# EAGLE design lcd_panel_adapter (EAGLE 9.6.2)
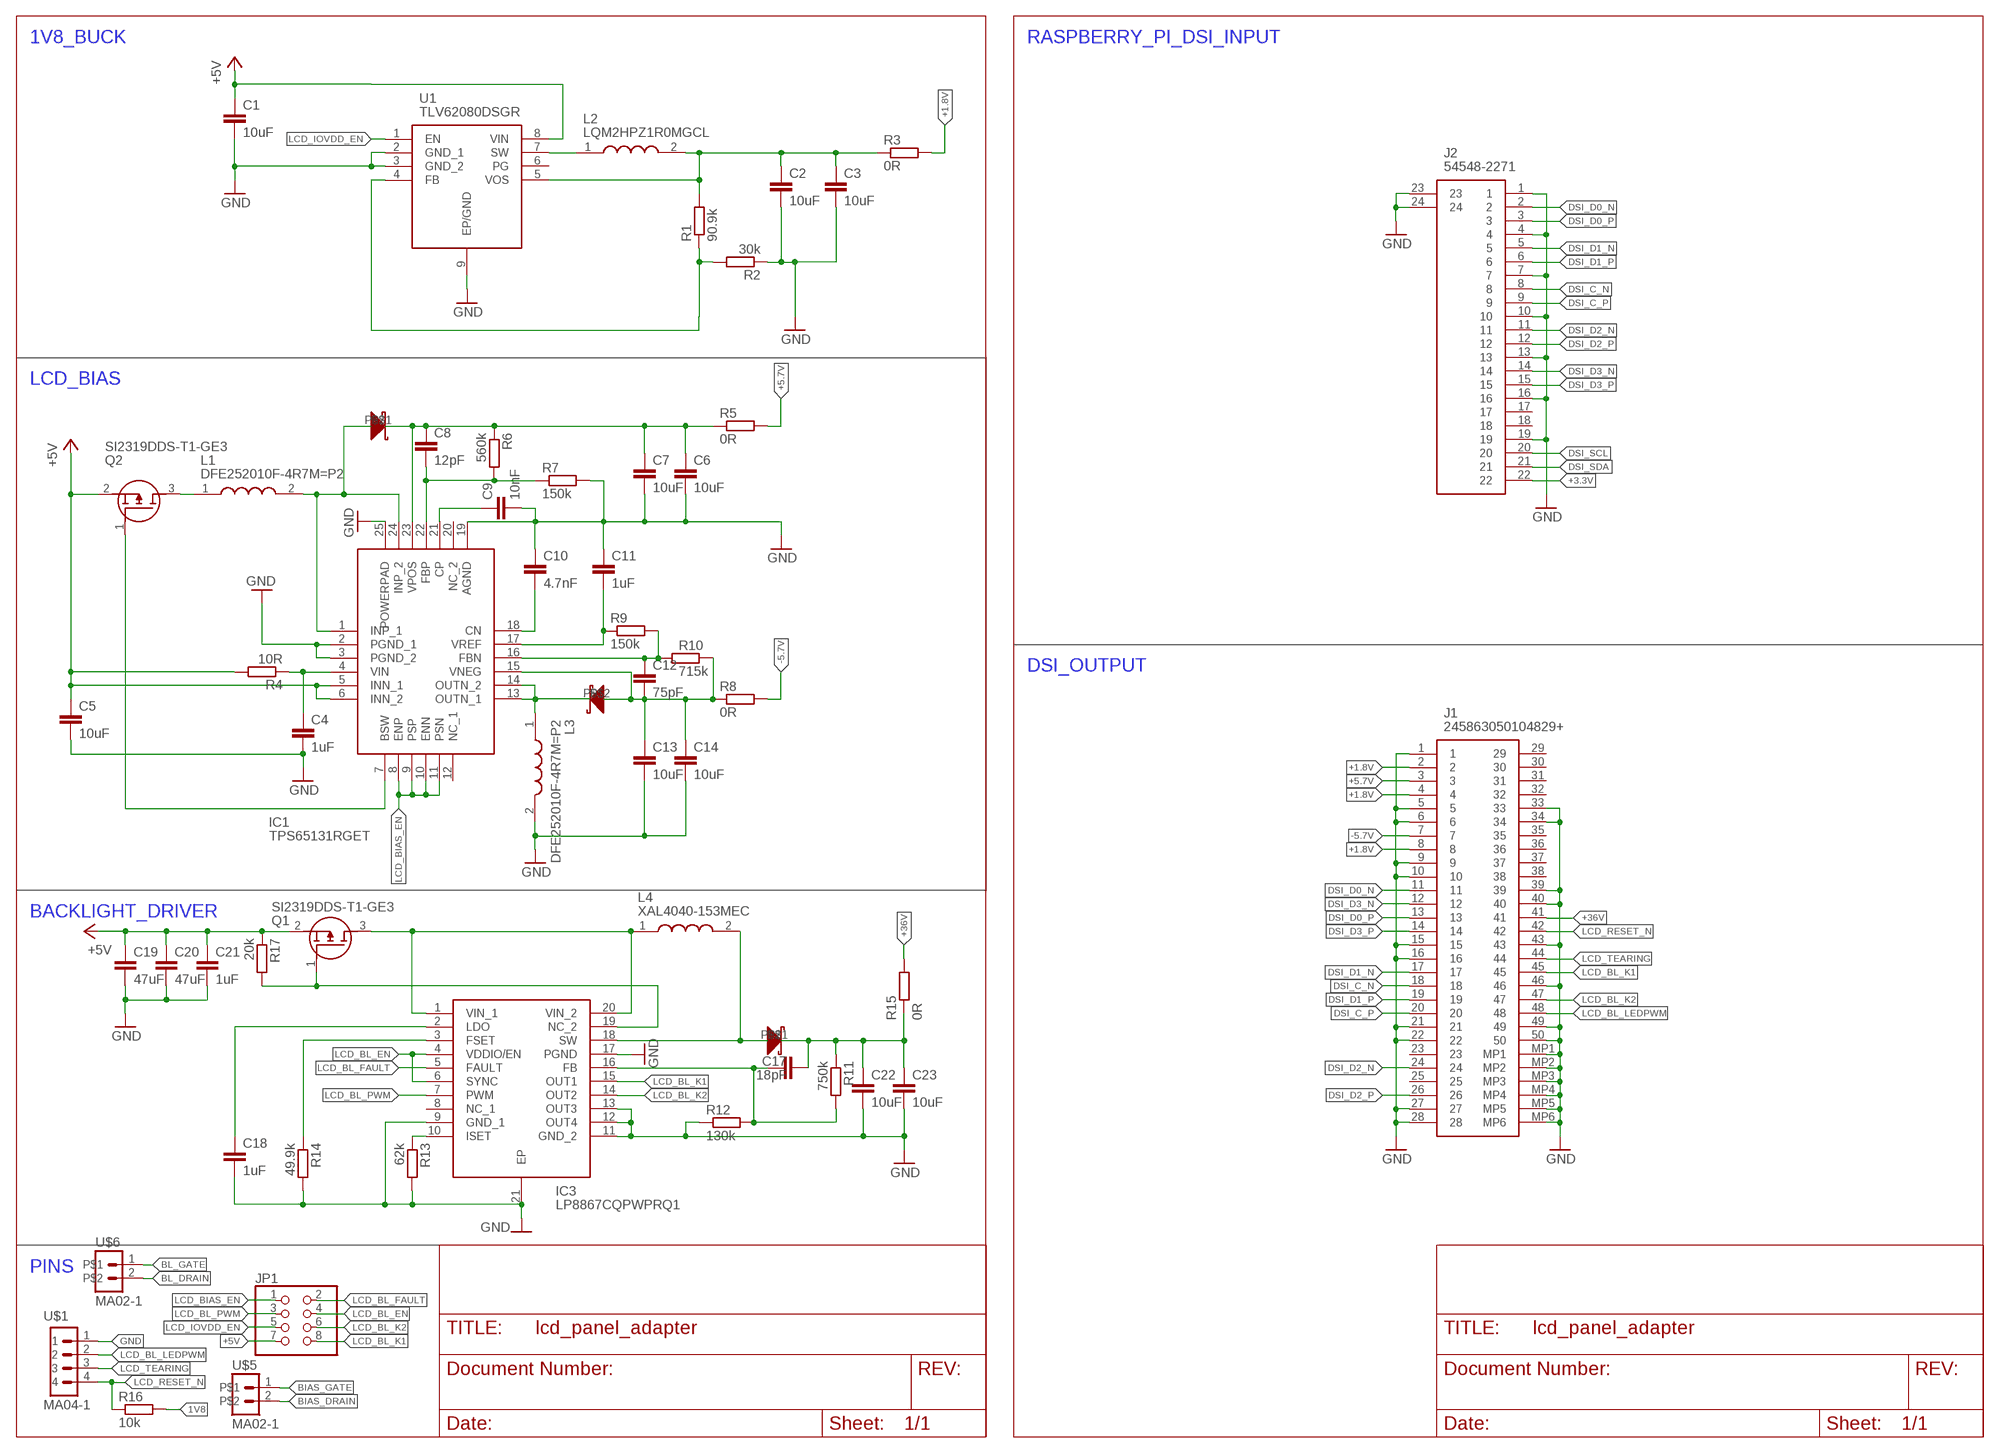
[diagram p0: schematic, sheet 1]

## Parts
C1  10uF  C-EUC0603  [C0603]
C2  10uF  C-EUC0603  [C0603]
C3  10uF  C-EUC0603  [C0603]
C4  1uF  C-EUC0603  [C0603]
C5  10uF  C-EUC0603  [C0603]
C6  10uF  C-EUC0603  [C0603]
C7  10uF  C-EUC0603  [C0603]
C8  12pF  C-EUC0603  [C0603]
C9  10nF  C-EUC0603  [C0603]
C10  4.7nF  C-EUC0603  [C0603]
C11  1uF  C-EUC0603  [C0603]
C12  75pF  C-EUC0603  [C0603]
C13  10uF  C-EUC0603  [C0603]
C14  10uF  C-EUC0603  [C0603]
C17  18pF  C-EUC0603  [C0603]
C18  1uF  C-EUC0603  [C0603]
C19  47uF  C-EUC0603  [C0603]
C20  47uF  C-EUC0603  [C0603]
C21  1uF  C-EUC0603  [C0603]
C22  10uF  C-EUC1206  [C1206]
C23  10uF  C-EUC1206  [C1206]
IC1  TPS65131RGET  [QFN50P400X400X100-25N]
IC3  LP8867CQPWPRQ1  TPS61194PWPR  [SOP65P640X120-21N]
J1  245863050104829+  [245863050104829]
J2  54548-2271  [545482271]
JP1  PINHD-2X4  [2X04]
L1  DFE252010F-4R7M=P2  [1269ASH100NP2]
L2  LQM2HPZ1R0MGCL  [LQM2HPN1R0MG0L]
L3  DFE252010F-4R7M=P2  [1269ASH100NP2]
L4  XAL4040-153MEC  [XAL4040153MEC]
Q1  SI2319DDS-T1-GE3  [SOT96P240X120-3N]
Q2  SI2319DDS-T1-GE3  [SOT96P240X120-3N]
R1  90.9k  R-EU_R0603  [R0603]
R2  30k  R-EU_R0603  [R0603]
R3  0R  R-EU_R0603  [R0603]
R4  10R  R-EU_R0603  [R0603]
R5  0R  R-EU_R0603  [R0603]
R6  560k  R-EU_R0603  [R0603]
R7  150k  R-EU_R0603  [R0603]
R8  0R  R-EU_R0603  [R0603]
R9  150k  R-EU_R0603  [R0603]
R10  715k  R-EU_R0603  [R0603]
R11  750k  R-EU_R0603  [R0603]
R12  130k  R-EU_R0603  [R0603]
R13  62k  R-EU_R0603  [R0603]
R14  49.9k  R-EU_R0603  [R0603]
R15  0R  R-EU_R0603  [R0603]
R16  10k  R-EU_R0603  [R0603]
R17  20k  R-EU_R0603  [R0603]
U1  TLV62080DSGR  [SON50P200X200X80-9N]
U$1  MA04-1  [MA04-1]
U$2  CUS10S40  [CUS10S40]
U$3  CUS10S40  [CUS10S40]
U$4  CUS10S40  [CUS10S40]
U$5  MA02-1  [MA02-1]
U$6  MA02-1  [MA02-1]

## Nets
1V8: C2.1 C3.1 L2.2 R1.2 R3.1 R16.2 U1.5(VOS)
+1.8V: J1.2 J1.4 J1.8 R3.2
+3.3V: J2.22
+5.7V: J1.3 R5.2
+5V: C1.1 C5.1 C19.1 C20.1 C21.1 IC1.5(INN_1) IC1.6(INN_2) JP1.7 Q1.2(S) Q2.2(S) R4.2 R17.1 U1.8(VIN)
+36V: J1.41 R15.2
-5.7V: J1.7 R8.2
BIAS_DRAIN: L1.1 Q2.3(D) U$5.2
BIAS_GATE: IC1.7(BSW) Q2.1(G) U$5.1
BL_DRAIN: IC3.1(VIN_1) IC3.20(VIN_2) L4.1 Q1.3(D) U$6.2
BL_GATE: IC3.19(NC_2) Q1.1(G) R17.2 U$6.1
DSI_C_N: J1.18 J2.8
DSI_C_P: J1.20 J2.9
DSI_D0_N: J1.11 J2.2
DSI_D0_P: J1.13 J2.3
DSI_D1_N: J1.17 J2.5
DSI_D1_P: J1.19 J2.6
DSI_D2_N: J1.24 J2.11
DSI_D2_P: J1.26 J2.12
DSI_D3_N: J1.12 J2.14
DSI_D3_P: J1.14 J2.15
DSI_SCL: J2.20
DSI_SDA: J2.21
FB: R1.1 R2.2 U1.4(FB)
GND: C1.2 C2.2 C3.2 C4.2 C5.2 C6.2 C7.2 C9.2 C10.1 C11.1 C13.2 C14.2 C18.2 C19.2 C20.2 C21.2 C22.2 C23.2 IC1.2(PGND_1) IC1.3(PGND_2) IC1.19(AGND) IC1.25(POWERPAD) IC3.9(GND_1) IC3.11(GND_2) IC3.12(OUT4) IC3.13(OUT3) IC3.17(PGND) IC3.21(EP) J1.1 J1.5 J1.6 J1.9 J1.10 J1.15 J1.16 J1.21 J1.22 J1.27 J1.28 J1.33 J1.34 J1.39 J1.40 J1.43 J1.46 J1.49 J1.50 J1.MP1 J1.MP2 J1.MP3 J1.MP4 J1.MP5 J1.MP6 J2.1 J2.4 J2.7 J2.10 J2.13 J2.16 J2.19 J2.23 J2.24 L3.2 R2.1 R7.2 R12.1 R13.2 R14.2 U1.2(GND_1) U1.3(GND_2) U1.9(EP/GND) U$1.1
LCD_BIAS_EN: IC1.8(ENP) IC1.9(PSP) IC1.10(ENN) IC1.11(PSN) JP1.1
LCD_BL_EN: IC3.4(VDDIO/EN) IC3.6(SYNC) JP1.4
LCD_BL_FAULT: IC3.5(FAULT) JP1.2
LCD_BL_K1: IC3.15(OUT1) J1.45 JP1.8
LCD_BL_K2: IC3.14(OUT2) J1.47 JP1.6
LCD_BL_LEDPWM: J1.48 U$1.2
LCD_BL_PWM: IC3.7(PWM) JP1.3
LCD_IOVDD_EN: JP1.5 U1.1(EN)
LCD_RESET_N: J1.42 R16.1 U$1.4
LCD_TEARING: J1.44 U$1.3
N$1: L2.1 U1.7(SW)
N$2: C4.1 IC1.4(VIN) R4.1
N$3: IC3.18(SW) L4.2 U$4.P$1
N$4: IC1.1(INP_1) IC1.24(INP_2) L1.2 U$2.P$1
N$5: IC1.13(OUTN_1) IC1.14(OUTN_2) L3.1 U$3.P$2
N$6: C6.1 C7.1 C8.1 IC1.23(VPOS) R5.1 R6.1 U$2.P$2
N$7: C9.1 IC1.21(CP)
N$8: C8.2 IC1.22(FBP) R6.2 R7.1
N$9: C12.2 C13.1 C14.1 IC1.15(VNEG) R8.1 R10.2 U$3.P$1
N$10: C11.2 IC1.17(VREF) R9.1
N$11: C10.2 IC1.18(CN)
N$12: C12.1 IC1.16(FBN) R9.2 R10.1
N$14: C17.1 IC3.16(FB) R11.2 R12.2
N$15: C18.1 IC3.2(LDO)
N$16: IC3.10(ISET) R13.1
N$17: IC3.3(FSET) R14.1
NET_WHATEVER: C17.2 C22.1 C23.1 R11.1 R15.1 U$4.P$2
Unconnected: IC1.12(NC_1) IC1.20(NC_2) IC3.8(NC_1) J1.23 J1.25 J1.29 J1.30 J1.31 J1.32 J1.35 J1.36 J1.37 J1.38 J2.17 J2.18 U1.6(PG)

## Notes on the sheet
- 1V8_BUCK | RASPBERRY_PI_DSI_INPUT
- LCD_BIAS
- DSI_OUTPUT
- BACKLIGHT_DRIVER
- PINS

## Library data of the parts
C1-C14 C17-C23 = rcl:C-EU: CAPACITOR, European symbol; SPICEPREFIX: C
IC1 = SamacSys_Parts:TPS65131RGET: Conv DC-DC Dual-OUT Inv/Step Up 24-Pin Texas Instruments TPS65131RGET, Dual Inverting, Step Up DC-DC Converter, 1.95A, Adjustable Source: Datasheet <http://www.ti.com/lit/ds/symlink/tps65130.pdf>; DESCRIPTION: Conv DC-DC Dual-OUT Inv/Step Up 24-Pin Texas Instruments TPS65131RGET, Dual Inverting, Step Up DC-DC Converter, 1.95A, Adjustable; HEIGHT: 1mm; MANUFACTURER_NAME: Texas Instruments; MANUFACTURER_PART_NUMBER: TPS65131RGET; MOUSER_PART_NUMBER: 595-TPS65131RGET; MOUSER_PRICE-STOCK: https://www.mouser.co.uk/ProductDetail/Texas-Instruments/TPS65131RGET?qs=Gse6rAGbi7%2FStiVl23F5Fg%3D%3D
IC3 = SamacSys_Parts:TPS61194PWPR: Low-EMI, High-Performance 4-Channel LED Driver Source: Datasheet <http://www.ti.com/lit/gpn/tps61194>; DESCRIPTION: Low-EMI, High-Performance 4-Channel LED Driver; HEIGHT: 1.2mm; MANUFACTURER_NAME: Texas Instruments; MANUFACTURER_PART_NUMBER: TPS61194PWPR; MOUSER_PART_NUMBER: 595-TPS61194PWPR; MOUSER_PRICE-STOCK: https://www.mouser.co.uk/ProductDetail/Texas-Instruments/TPS61194PWPR?qs=l4JqiU1WKg1XqvPt9th3XQ%3D%3D
J1 = SamacSys_Parts:245863050104829+: Board to Board & Mezzanine Connectors RECPT 0.35mm Pitch 50pos 8.0mm Height Source: Datasheet <https://www.mouser.co.uk/datasheet/2/909/5863-1602212.pdf>; DESCRIPTION: Board to Board & Mezzanine Connectors RECPT 0.35mm Pitch 50pos 8.0mm Height; HEIGHT: 0.86mm; MANUFACTURER_NAME: Kyocera Electronic Components; MANUFACTURER_PART_NUMBER: 245863050104829+; MOUSER_PART_NUMBER: 346-245863050104829+; MOUSER_PRICE-STOCK: https://www.mouser.co.uk/ProductDetail/Kyocera-Electronic-Components/245863050104829%2b?qs=PzGy0jfpSMtGhQjnwghOpA%3D%3D
J2 = SamacSys_Parts:54548-2271: FFC & FPC Connectors 0.5 FPC ZIF Hsg Assy ssy 22Ckt EmbsTp Pkg Source: Datasheet <http://www.molex.com/webdocs/datasheets/pdf/en-us//0545482271_FFC_FPC_CONNECTORS.pdf>; DESCRIPTION: FFC & FPC Connectors 0.5 FPC ZIF Hsg Assy ssy 22Ckt EmbsTp Pkg; HEIGHT: 1mm; MANUFACTURER_NAME: Molex; MANUFACTURER_PART_NUMBER: 54548-2271; MOUSER_PART_NUMBER: 538-54548-2271; MOUSER_PRICE-STOCK: https://www.mouser.co.uk/ProductDetail/Molex/54548-2271?qs=qM7ngqbhX5X3ZiWzRWv9wA%3D%3D
JP1 = custom_library:PINHD-2X4: PIN HEADER
L1 L3 = SamacSys_Parts:DFE252010F-4R7M=P2: DFE252010F Series Inductor 4.7uH +/-20% 1008 (2520) Source: Datasheet <https://componentsearchengine.com/Datasheets/1/DFE252010F-4R7M=P2.pdf>; DESCRIPTION: DFE252010F Series Inductor 4.7uH +/-20% 1008 (2520); HEIGHT: 1mm; MANUFACTURER_NAME: Murata Electronics; MANUFACTURER_PART_NUMBER: DFE252010F-4R7M=P2; MOUSER_PART_NUMBER: 81-DFE252010F-4R7MP2; MOUSER_PRICE-STOCK: https://www.mouser.com/Search/Refine.aspx?Keyword=81-DFE252010F-4R7MP2
L2 = SamacSys_Parts:LQM2HPZ1R0MGCL: LQM2HPZ_GC Series Inductor 1.0uH +/-20% 1008 (2520) Source: Datasheet <https://psearch.en.murata.com/inductor/product/LQM2HPZ1R0MGC#.html>; DESCRIPTION: LQM2HPZ_GC Series Inductor 1.0uH +/-20% 1008 (2520); HEIGHT: 1mm; MANUFACTURER_NAME: Murata Electronics; MANUFACTURER_PART_NUMBER: LQM2HPZ1R0MGCL
L4 = SamacSys_Parts:XAL4040-153MEC: COILCRAFT - XAL4040-153MEC - INDUCTOR, 15UH, 2.8A, 20%, PWR, 20MHZ Source: Datasheet; DESCRIPTION: COILCRAFT - XAL4040-153MEC - INDUCTOR, 15UH, 2.8A, 20%, PWR, 20MHZ; HEIGHT: 4.1mm; MANUFACTURER_NAME: COILCRAFT; MANUFACTURER_PART_NUMBER: XAL4040-153MEC; MOUSER_PART_NUMBER: 994-XAL4040-153MEC; MOUSER_PRICE-STOCK: https://www.mouser.co.uk/ProductDetail/Coilcraft/XAL4040-153MEC?qs=zCSbvcPd3papbG%2FB%2F2voqg%3D%3D
Q1 Q2 = SamacSys_Parts:SI2319DDS-T1-GE3: Si2319DDS-T1-GE3 P-Channel MOSFET, 3.6 A, 40 V TrenchFET, 3-Pin SOT-23 Vishay Siliconix Source: Datasheet <https://www.vishay.com/docs/79400/si2319dds.pdf>; DESCRIPTION: Si2319DDS-T1-GE3 P-Channel MOSFET, 3.6 A, 40 V TrenchFET, 3-Pin SOT-23 Vishay Siliconix; HEIGHT: 1.2mm; MANUFACTURER_NAME: Vishay; MANUFACTURER_PART_NUMBER: SI2319DDS-T1-GE3; MOUSER_PART_NUMBER: 78-SI2319DDS-T1-GE3; MOUSER_PRICE-STOCK: https://www.mouser.co.uk/ProductDetail/Vishay-Siliconix/SI2319DDS-T1-GE3?qs=y6ZabgHbY%252Bx8ctUGtA%252BsMQ%3D%3D
R1-R17 = rcl:R-EU_: RESISTOR, European symbol; SPICEPREFIX: R
U1 = SamacSys_Parts:TLV62080DSGR: Conv DC-DC 2.5V to 5.5V Step Down Single-Out 0.5V to 4V 1.2A 8-Pin WSON EP T/R Source: Datasheet <https://www.arrow.com/en/products/tlv62080dsgr/texas-instruments>; DESCRIPTION: Conv DC-DC 2.5V to 5.5V Step Down Single-Out 0.5V to 4V 1.2A 8-Pin WSON EP T/R; HEIGHT: 0.8mm; MANUFACTURER_NAME: Texas Instruments; MANUFACTURER_PART_NUMBER: TLV62080DSGR; MOUSER_PART_NUMBER: 595-TLV62080DSGR; MOUSER_PRICE-STOCK: https://www.mouser.co.uk/ProductDetail/Texas-Instruments/TLV62080DSGR/?qs=gXEV9p%2FxLgfU3Hst4s8Ulg%3D%3D
U$1 = custom_library:MA04-1
U$2-U$4 = custom_library:CUS10S40
U$5 U$6 = custom_library:MA02-1

## Board
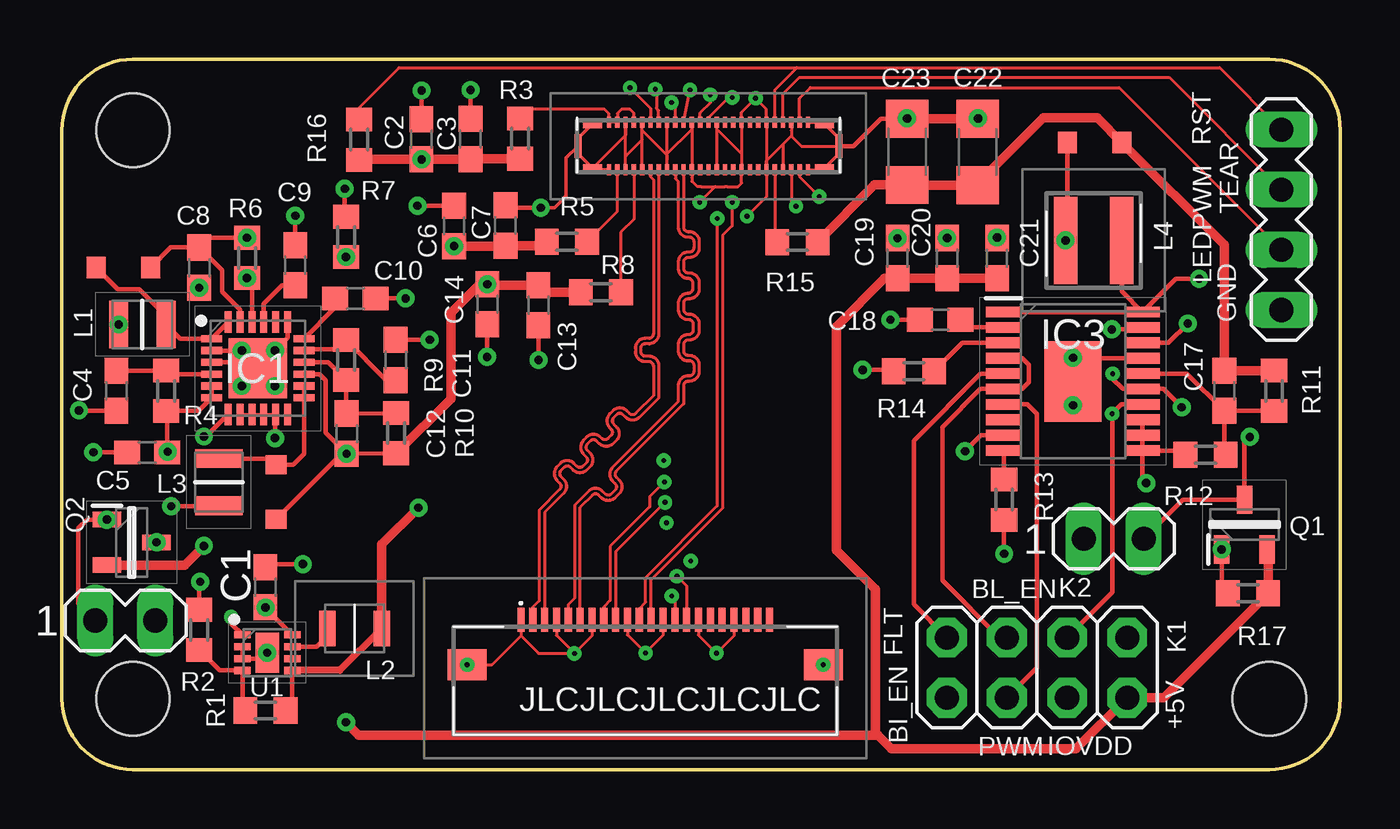
[diagram p1: board, top side]
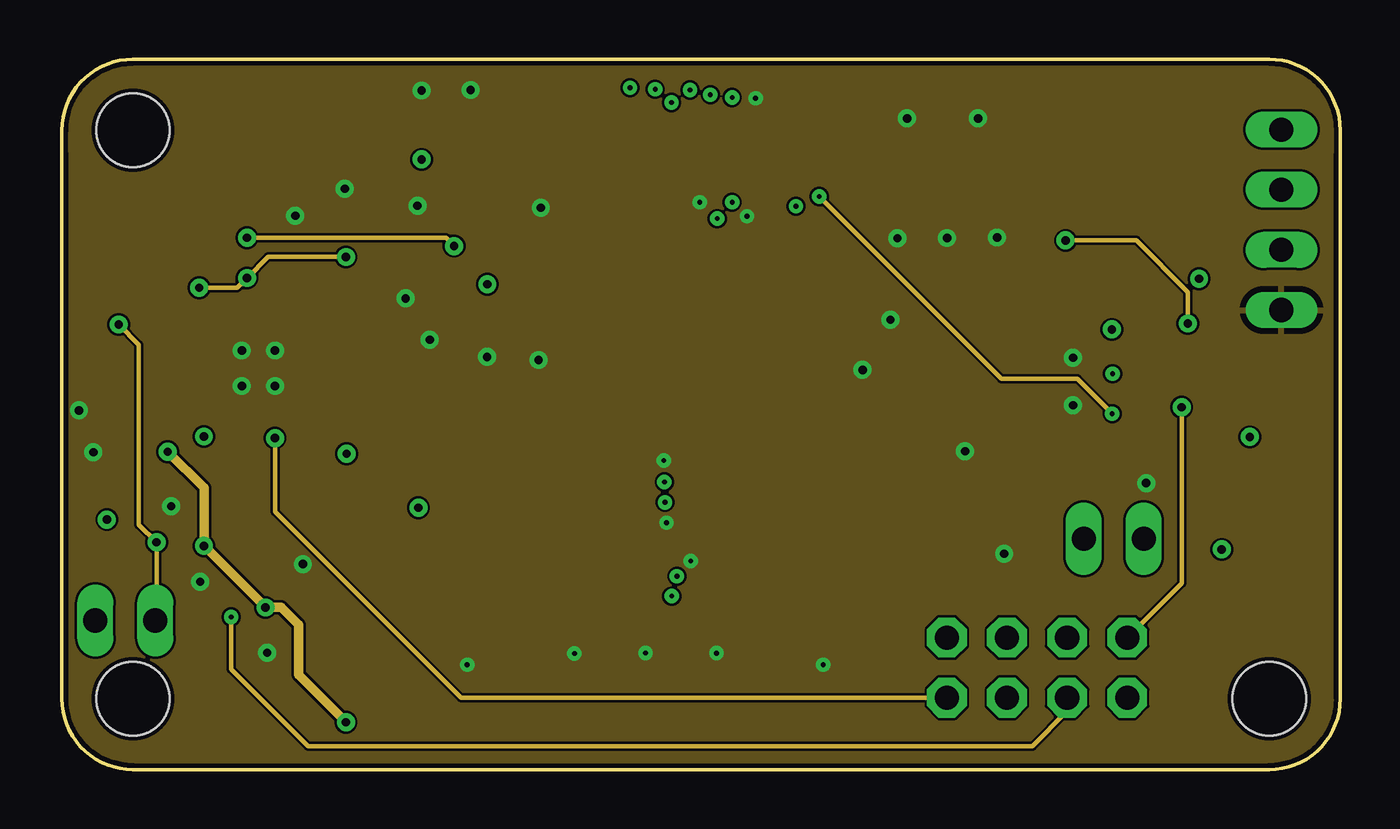
[diagram p2: board, inner layer Route2]
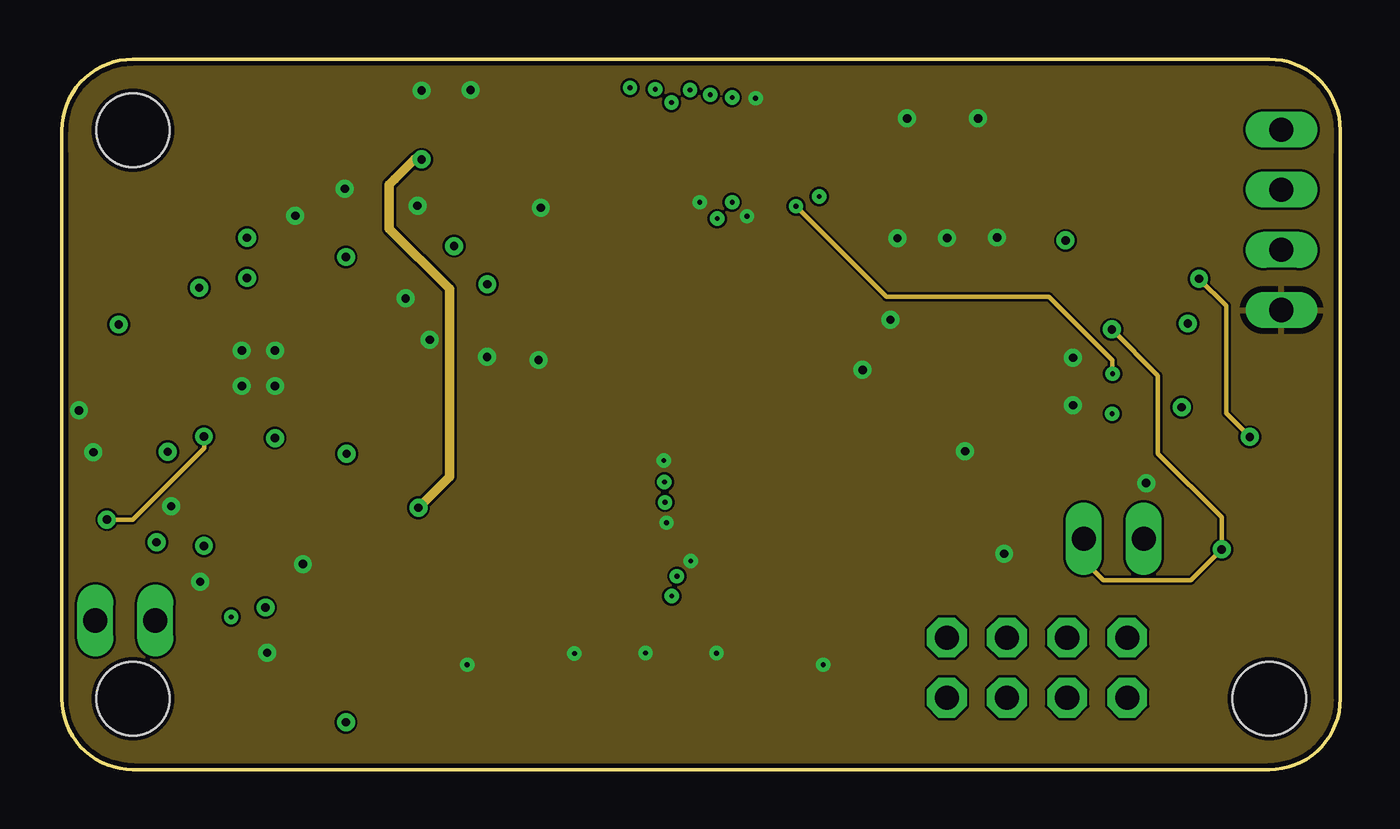
[diagram p3: board, inner layer Route15]
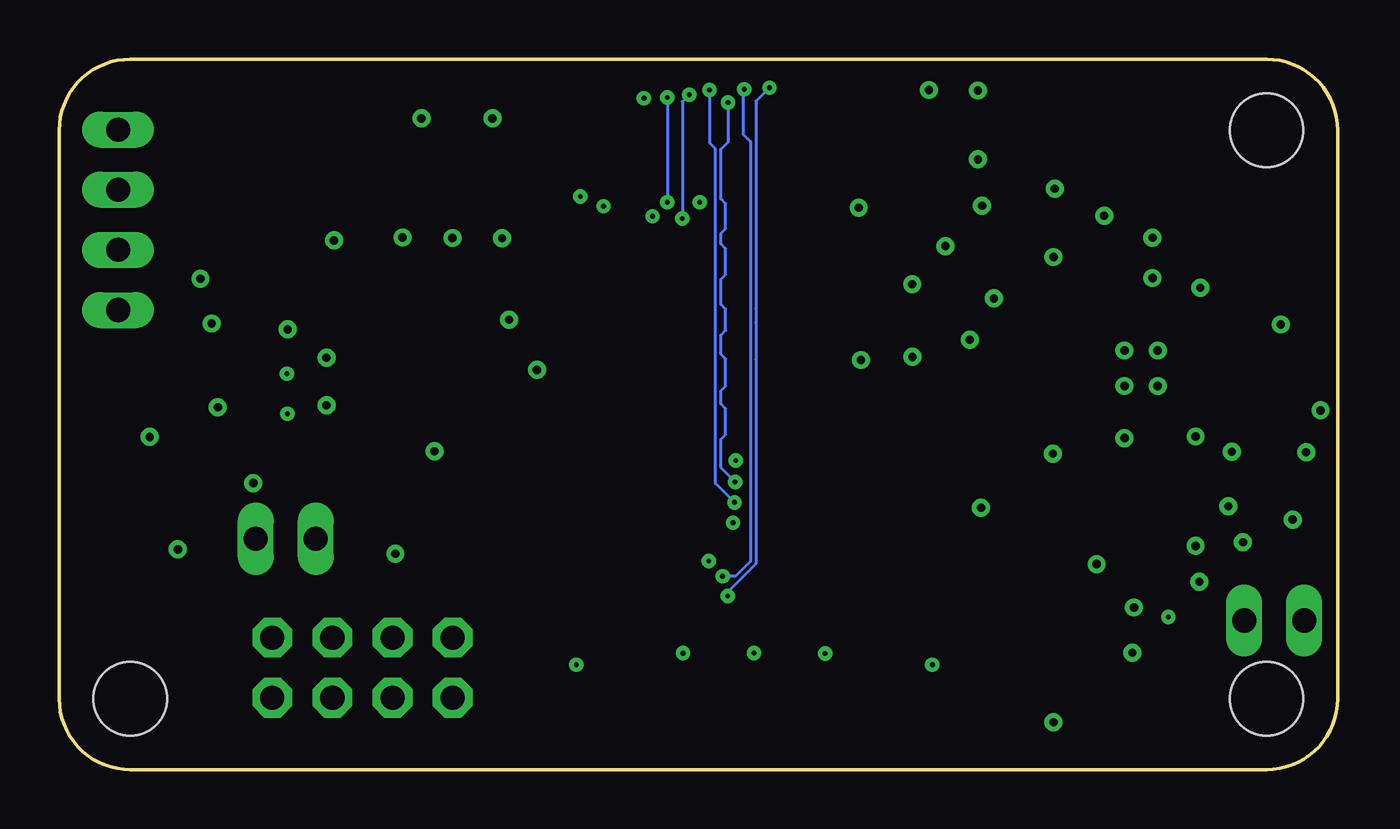
[diagram p4: board, bottom side, seen from below]

Size 54 x 30 mm. Coordinates in mm from the lower left corner, seen from the top.
Outline: 3,0 51,0 arc90 54,3 54,26 54,27 arc90 51,30 3,30 arc90 0,27 0,26 0,3 arc90 3,0
Copper layers (1+2*15+16): Top 0.035mm / dielectric 0.2mm / Route2 0.0175mm / dielectric 1.065mm / Route15 0.0175mm / dielectric 0.2mm / Bottom 0.035mm
Design rules "default *": minimum track width 3.5mil, minimum drill 0.2mm, track to track 4mil, track to pad 3.5mil, pad to pad 5mil, via to via 10mil, smd to smd 5mil, copper to edge 0.2mm, drill to drill 6mil, minimum pad ring 10mil, minimum via ring 8mil, stop-mask expansion 4mil, vias tented up to drill 0mil, thermal gap 10mil
Holes 3.1 mm at 3,27 51,3 3,3

### Footprints (pad centres in the part's own frame; a part is rotated, then mirrored left to right if it is on the bottom)
C0603 = smd 1.1 x 1: 1 -0.85,0; 2 0.85,0
C1206 = smd 1.6 x 1.8: 1 -1.4,0; 2 1.4,0
QFN50P400X400X100-25N = smd 0.9 x 0.3: 1 -1.95,1.25; 2 -1.95,0.75; 3 -1.95,0.25; 4 -1.95,-0.25; 5 -1.95,-0.75; 6 -1.95,-1.25; 13 1.95,-1.25; 14 1.95,-0.75; 15 1.95,-0.25; 16 1.95,0.25; 17 1.95,0.75; 18 1.95,1.25 | smd 0.3 x 0.9: 7 -1.25,-1.95; 8 -0.75,-1.95; 9 -0.25,-1.95; 10 0.25,-1.95; 11 0.75,-1.95; 12 1.25,-1.95; 19 1.25,1.95; 20 0.75,1.95; 21 0.25,1.95; 22 -0.25,1.95; 23 -0.75,1.95; 24 -1.25,1.95 | smd 2.45 x 2.55: 25 0,0
SOP65P640X120-21N = smd 1.475 x 0.45: 1 -2.938,2.925; 2 -2.938,2.275; 3 -2.938,1.625; 4 -2.938,0.975; 5 -2.938,0.325; 6 -2.938,-0.325; 7 -2.938,-0.975; 8 -2.938,-1.625; 9 -2.938,-2.275; 10 -2.938,-2.925; 11 2.938,-2.925; 12 2.938,-2.275; 13 2.938,-1.625; 14 2.938,-0.975; 15 2.938,-0.325; 16 2.938,0.325; 17 2.938,0.975; 18 2.938,1.625; 19 2.938,2.275; 20 2.938,2.925 | smd 2.4 x 3.4: 21 0,0
245863050104829 = smd 0.18 x 0.467: 1 -4.2,-1.004; 2 -4.2,1.004; 3 -3.85,-1.004; 4 -3.85,1.004; 5 -3.5,-1.004; 6 -3.5,1.004; 7 -3.15,-1.004; 8 -3.15,1.004; 9 -2.8,-1.004; 10 -2.8,1.004; 11 -2.45,-1.004; 12 -2.45,1.004; 13 -2.1,-1.004; 14 -2.1,1.004; 15 -1.75,-1.004; 16 -1.75,1.004; 17 -1.4,-1.004; 18 -1.4,1.004; 19 -1.05,-1.004; 20 -1.05,1.004; 21 -0.7,-1.004; 22 -0.7,1.004; 23 -0.35,-1.004; 24 -0.35,1.004; 25 0,-1.004; 26 0,1.004; 27 0.35,-1.004; 28 0.35,1.004; 29 0.7,-1.004; 30 0.7,1.004; 31 1.05,-1.004; 32 1.05,1.004; 33 1.4,-1.004; 34 1.4,1.004; 35 1.75,-1.004; 36 1.75,1.004; 37 2.1,-1.004; 38 2.1,1.004; 39 2.45,-1.004; 40 2.45,1.004; 41 2.8,-1.004; 42 2.8,1.004; 43 3.15,-1.004; 44 3.15,1.004; 45 3.5,-1.004; 46 3.5,1.004; 47 3.85,-1.004; 48 3.85,1.004; 49 4.2,-1.004; 50 4.2,1.004 | smd 0.3 x 1: MP1 -5.51,0; MP2 5.51,0 | smd 0.8 x 0.35: MP3 -4.9,0.935; MP4 4.9,0.935; MP5 4.9,-0.935; MP6 -4.9,-0.935
545482271 = smd 0.3 x 1: 1 -5.25,2.05; 2 -4.75,2.05; 3 -4.25,2.05; 4 -3.75,2.05; 5 -3.25,2.05; 6 -2.75,2.05; 7 -2.25,2.05; 8 -1.75,2.05; 9 -1.25,2.05; 10 -0.75,2.05; 11 -0.25,2.05; 12 0.25,2.05; 13 0.75,2.05; 14 1.25,2.05; 15 1.75,2.05; 16 2.25,2.05; 17 2.75,2.05; 18 3.25,2.05; 19 3.75,2.05; 20 4.25,2.05; 21 4.75,2.05; 22 5.25,2.05 | smd 1.65 x 1.3: 23 -7.525,0.15; 24 7.525,0.15
2X04 = drill 1.016 pad 1.676 octagon: 1 -3.81,-1.27; 2 -3.81,1.27; 3 -1.27,-1.27; 4 -1.27,1.27; 5 1.27,-1.27; 6 1.27,1.27; 7 3.81,-1.27; 8 3.81,1.27
1269ASH100NP2 = smd 0.8 x 2: 1 -1,0; 2 1,0
LQM2HPN1R0MG0L = smd 0.7 x 1.5: 1 -1.15,0; 2 1.15,0
XAL4040153MEC = smd 0.98 x 3.7: 1 -1.185,0; 2 1.185,0
SOT96P240X120-3N = smd 1.2 x 0.65: 1 -1.05,0.96; 2 -1.05,-0.96; 3 1.05,0
R0603 = smd 1 x 1.1: 1 -0.85,0; 2 0.85,0
SON50P200X200X80-9N = smd 0.7 x 0.3: 1 -1.05,0.75; 2 -1.05,0.25; 3 -1.05,-0.25; 4 -1.05,-0.75; 5 1.05,-0.75; 6 1.05,-0.25; 7 1.05,0.25; 8 1.05,0.75 | smd 1 x 1.7: 9 0,0
MA04-1 = drill 1.016 long: 1 -2.54,0; 2 0,0; 3 2.54,0; 4 5.08,0
CUS10S40 = smd 0.8 x 0.9: P$1 1.15,0; P$2 -1.15,0
MA02-1 = drill 1.016 long: 1 -2.54,0; 2 0,0

### Placement (x,y rotation side)
C1  8.6,7.7 90 top
C2  15.19,26.62 90 top
C3  17.26,26.63 90 top
C4  2.3,16 270 top
C5  3.6,13.4 180 top
C6  16.57,22.96 90 top
C7  18.74,22.98 90 top
C8  5.8,21.2 270 top
C9  9.86,21.3 90 top
C10  12.4,19.9 180 top
C11  14.1,17.3 270 top
C12  12.03,14.19 270 top
C13  20.13,19.61 270 top
C14  17.97,19.65 270 top
C17  49.1,16 90 top
C18  37.1,19 180 top
C19  35.3,21.6 90 top
C20  37.4,21.6 90 top
C21  39.5,21.6 90 top
C22  38.68,26.08 90 top
C23  35.71,26.09 90 top
IC1  8.28,16.95 0 top
IC3  42.71,16.4 0 top
J1  27.31,26.33 0 top
J2  24.64,4.28 0 top
JP1  41.19,4.31 0 top
L1  3.4,18.8 0 top
L2  12.36,5.96 0 top
L3  6.63,12.14 270 top
L4  43.58,22.35 180 top
Q1  49.95,10.35 90 top
Q2  2.95,9.6 0 top
R1  8.6,2.5 0 top
R2  5.8,5.9 270 top
R3  19.35,26.65 90 top
R4  4.4,16 270 top
R5  21.33,22.29 0 top
R6  7.82,21.61 270 top
R7  12,22.5 90 top
R8  22.77,20.16 0 top
R9  12,17.3 270 top
R10  14.12,14.21 270 top
R11  51.2,16 270 top
R12  48.3,13.3 0 top
R13  39.8,11.4 270 top
R14  35.99,16.83 180 top
R15  31.07,22.28 180 top
R16  12.55,26.6 270 top
R17  50.1,7.45 180 top
U1  8.68,4.94 0 top
U$1  51.51,21.95 90 top
U$2  2.6,21.2 180 top
U$3  9.05,11.73 270 top
U$4  43.63,26.48 180 top
U$5  3.95,6.3 0 top
U$6  45.7,9.75 0 top

### Tracks (layer width: path | path; a pad name or v marks a point on that pad's centre or on a via)
1V8  (via drill 0.35)
  Top 0.2: R1.2 9.73,2.78 U1.5 | C2.1 | C3.1 17.28,25.8
  Top 0.3: U1.5 11.74,4.19 L2.2
  Top 0.4: C3.1 C2.1 12.58,25.78 R16.2 | 17.28,25.8 R3.1 | L2.2 13.51,9.51 v15.06,11.06
  Route15 0.4: v15.06,11.06 16.37,12.37 16.37,20.3 13.82,22.85 13.82,24.7 14.06,24.94 14.89,25.77 C2.1
  other vias: 15.19,25.77
+1.8V
  Top 0.127: J1.8 24.16,27.72 23.99,27.89 23.64,27.89 23.46,27.71 J1.4 J1.2 23.11,27.7 22.93,27.88 19.73,27.88 | 19.73,27.88 R3.2 19.73,27.88
+5.7V
  Top 0.127: R5.2 23.46,23.57 J1.3
+5V  (via drill 0.35)
  Top 0.2: U1.8 8.6,6.82 C1.1 | IC1.5 IC1.6 5.78,15.15 R4.2 4.45,15.1 C5.1 | 39.77,20.48 C21.1 39.77,20.48
  Top 0.4: C19.1 34.75,20.75 32.71,18.71 32.71,9.27 34.37,7.61 34.37,1.56 34.47,1.47 | 34.47,1.47 35.05,0.88 42.84,0.88 JP1.7 | 34.47,1.47 12.54,1.47 v12,2
  Top 0.406: JP1.7 46.54,3.04 R17.1 50.95,9.26 Q1.2 | C19.1 C20.1 C21.1 | Q2.2 5.19,8.64 v6,9.45 | v4.47,13.43 C5.1
  Route2 0.4: v12,2 9.99,4.01 9.99,6.12 9.26,6.85 C1.1 v6,9.45 6,11.84
  Route2 0.406: 6,11.84 6,11.9 v4.47,13.43
  other vias: 8.6,6.85
+36V
  Top 0.127: J1.41 30.11,22.39 R15.2
-5.7V
  Top 0.127: J1.7 24.16,23.25 23.6,22.69 23.6,20.18 R8.2
BIAS_DRAIN  (via drill 0.35)
  Route2 0.2: L1.1 3.25,17.95 3.25,10.35 Q2.3 4,6.35 U$5.2
  other vias: 2.4,18.8 4,9.6
BIAS_GATE  (via drill 0.35)
  Top 0.2: IC1.7 6.1,14.07 v6,14.07 | Q2.1 1.06,10.56 0.7,10.2 0.7,7.01 U$5.1
  Route15 0.2: v6,14.07 6,13.57 2.99,10.56 Q2.1
  other vias: 1.9,10.56
BL_DRAIN  (via drill 0.35)
  Top 0.2: L4.1 44.77,20.21 IC3.20 | IC3.1 IC3.20 | v50.18,14.05 49.95,13.82 Q1.3 47.35,11.4 U$6.2 | IC3.20 47.06,20.73 v48.03,20.73
  Route15 0.2: v50.18,14.05 49.18,15.05 49.18,19.59 v48.03,20.73
BL_GATE  (via drill 0.35)
  Top 0.2: R17.2 48.99,7.71 Q1.1 | IC3.19 45.57,18.59 v44.35,18.59
  Route15 0.2: v44.35,18.59 46.3,16.64 46.3,13.35 48.99,10.66 Q1.1 47.69,8 44,8 43.16,8.84 U$6.1
  other vias: 48.99,9.3
DSI_C_N  (via drill 0.2)
  Top 0.127: J1.18 25.91,28.01 v25.75,28.17 | v25.45,12.15 24.83,11.53 24.83,11.1 23.16,9.43 23.16,7.15 22.89,6.88 J2.8
  Bottom 0.127: v25.45,12.15 26.05,12.75 26.05,13.95 25.85,14.15 25.85,15.25 26.05,15.45 26.05,16 25.85,16.2 25.85,17.35 26.05,17.55 26.05,18.35 25.85,18.55 25.85,19.45 26.05,19.65 26.05,20.7 25.85,20.9 25.85,22 26.05,22.2 26.05,22.65 25.85,22.85 25.85,23.9 26.05,24.1 26.05,26.2 25.75,26.5 v25.75,28.17
DSI_C_P  (via drill 0.2)
  Top 0.127: v25.47,11.29 | v25.47,11.29 23.39,9.21 J2.9 | J1.20 v26.53,28.7
  Bottom 0.127: v25.47,11.29 26.28,12.1 26.28,26.22 26.52,26.46 v26.52,28.69 v26.53,28.7
DSI_D0_N
  Top 0.127: J1.11 24.86,25.04 24.98,24.92 24.98,18.4 arc-90 24.79,18.21 24.64,18.21 arc90 24.22,17.79 24.22,17.66 arc90 24.64,17.24 24.79,17.24 arc-90 24.98,17.05 24.98,15.79 24.24,15.04 arc-90 23.97,15.04 23.86,15.15 arc90 23.27,15.15 23.14,15.03 arc90 23.14,14.43 23.2,14.38 arc-90 23.2,14.11 23.07,13.99 arc-90 22.8,13.99 22.75,14.04 arc90 22.16,14.04 22.03,13.91 arc90 22.03,13.32 22.14,13.21 arc-90 22.14,12.94 22.02,12.82 arc-90 21.75,12.82 21.64,12.93 arc90 21.05,12.93 20.92,12.8 arc90 20.92,12.21 21.03,12.1 arc-90 21.03,11.83 20.16,10.96 20.16,7.13 19.89,6.86 J2.2
DSI_D0_P
  Top 0.127: J1.13 25.21,18.4 arc-90 24.79,17.98 24.64,17.98 arc90 24.45,17.79 24.45,17.66 arc90 24.64,17.47 24.79,17.47 arc-90 25.21,17.05 25.21,15.69 24.4,14.88 arc-90 23.81,14.88 23.7,14.99 arc90 23.43,14.99 23.31,14.87 arc90 23.31,14.6 23.41,14.49 arc-90 23.41,13.89 23.29,13.77 arc-90 22.7,13.77 22.59,13.88 arc90 22.32,13.88 22.19,13.75 arc90 22.19,13.48 22.3,13.38 arc-90 22.3,12.78 22.18,12.66 arc-90 21.59,12.66 21.48,12.77 arc90 21.21,12.77 21.08,12.64 arc90 21.08,12.37 21.19,12.26 arc-90 21.19,11.67 20.39,10.87 J2.3
DSI_D1_N
  Top 0.127: J1.17 25.91,24.96 26.03,24.84 26.03,22.91 arc90 26.45,22.49 26.5,22.49 arc-90 26.69,22.3 26.69,22.04 arc-90 26.5,21.85 26.45,21.85 arc90 26.03,21.43 26.03,21.17 arc90 26.45,20.75 arc-90 26.64,20.56 26.64,20.3 arc-90 26.45,20.11 arc90 26.03,19.69 26.03,19.43 arc90 26.45,19.01 26.47,19.01 arc-90 26.66,18.82 26.66,18.56 arc-90 26.47,18.37 26.45,18.37 arc90 26.03,17.95 26.03,17.69 arc90 26.45,17.27 26.5,17.27 arc-90 26.69,17.08 26.69,16.82 arc-90 26.5,16.63 26.45,16.63 arc90 26.03,16.21 26.03,15.54 23.26,12.78 arc90 23.26,12.18 23.37,12.08 arc-90 23.37,11.81 23.21,11.65 arc-90 22.94,11.65 22.84,11.76 arc90 22.24,11.76 21.66,11.18 21.66,7.24 21.39,6.97 J2.5
DSI_D1_P
  Top 0.127: J2.6 21.89,11.08 22.41,11.6 arc-90 22.67,11.6 22.78,11.49 arc90 23.38,11.49 23.53,11.64 arc90 23.53,12.24 23.42,12.35 arc-90 23.42,12.61 26.26,15.45 26.26,16.21 arc-90 26.45,16.4 26.5,16.4 arc90 26.92,16.82 26.92,17.08 arc90 26.5,17.5 26.45,17.5 arc-90 26.26,17.69 26.26,17.95 arc-90 26.45,18.14 26.5,18.14 arc90 26.92,18.56 26.92,18.82 arc90 26.5,19.24 26.45,19.24 arc-90 26.26,19.43 26.26,19.69 arc-90 26.45,19.88 26.5,19.88 arc90 26.92,20.3 26.92,20.56 arc90 26.5,20.98 26.45,20.98 arc-90 26.26,21.17 26.26,21.43 arc-90 26.45,21.62 26.5,21.62 arc90 26.92,22.04 26.92,22.3 arc90 26.5,22.72 26.45,22.72 arc-90 26.26,22.91 J1.19
DSI_D2_N  (via drill 0.2)
  Top 0.127: J2.11 24.39,6.8 24.66,7.07 24.66,8.12 27.68,11.13 v27.68,23.27 | v27.39,28.5 27.39,28.16 26.96,27.73 J1.24
  Bottom 0.127: v27.39,28.5 27.68,28.21 v27.68,23.27
DSI_D2_P  (via drill 0.2)
  Top 0.127: J2.12 24.89,8.02 27.68,10.81 27.77,10.89 27.91,11.04 27.91,22.56 28.31,22.96 v28.31,23.96 | v28.31,28.38 28.16,28.38 27.31,27.53 J1.26
  Bottom 0.127: v28.31,28.38 v28.31,23.96
DSI_D3_N  (via drill 0.2)
  Top 0.127: v25.76,7.33 25.89,7.2 J2.14 | v24,28.8 24.86,27.94 J1.12
  Bottom 0.127: v25.76,7.33 25.76,7.51 24.57,8.7 24.57,17.33 | v24,28.8 24.57,28.23 24.57,19.47 24.57,18.88 | 24.57,17.33 | 24.57,18.88 24.57,17.33 | 24.57,18.88
DSI_D3_P  (via drill 0.2)
  Top 0.127: v25.98,8.17 26.39,7.76 J2.15 | J1.14 25.21,27.83 25.11,27.93 25.11,28.68 v25.06,28.73
  Bottom 0.127: v25.98,8.17 25.42,8.17 24.8,8.79 24.8,16.74 | v25.06,28.73 25.11,28.68 25.11,26.83 24.8,26.52 24.8,16.74 | 24.8,16.74
FB
  Top 0.2: R1.1 7.63,2.62 U1.4 6.66,4.19 R2.2
GND  (via drill 0.2, 0.35)
  Top 0.127: J2.1 19.39,5.65 | v21.65,4.91 20.13,4.91 19.39,5.65 | J2.23 18.17,4.43 19.39,5.65 | J2.7 22.39,5.65 v21.65,4.91 | J2.4 20.89,5.67 v21.65,4.91 | J2.13 25.39,5.67 v24.65,4.93 23.89,5.69 J2.10 | J2.16 26.89,5.68 v27.65,4.92 28.39,5.66 J2.19 | J1.50 32.14,27.33 J1.MP4 | J1.49 32.14,25.33 J1.MP5 | 27.6,24.62 27,24.62 26.84,24.62 26.61,24.85 26.61,25 J1.21 26.61,27.2 | 27.6,24.62 28,24.62 28.1,24.62 28.56,24.62 28.71,24.77 J1.33 28.71,26 | J1.1 22.68,25.33 22.51,25.5 J1.MP6 23.81,26.8 J1.6 J1.5 23.81,25.9 24.51,26.6 | J1.9 24.51,26.6 | 24.51,26.6 24.51,27 | 24.51,27 J1.10 | J1.15 25.56,25.75 | 25.56,25.75 25.56,26 | 25.56,26 J1.16 | J1.22 26.61,27.2 | J1.28 27.66,27 | 27.66,27 J1.27 | 28.71,26 J1.34 28.71,27.76 v29.3,28.35 29.76,27.89 J1.40 J1.39 | J1.46 30.81,27 | 30.81,27 30.81,26.75 31.23,26.33 J1.MP2 | 30.81,27 30.81,26.76 30.46,26.41 | 30.46,26.41 30.46,26 J1.43 | J1.39 29.76,24.19 v28.94,23.37 | J1.39 29.76,25.71 30.46,26.41 | 25.56,26 26.61,27.05 26.61,27.2 | 24.51,27 25.56,25.95 25.56,25.75 | 27.66,27 27.71,27 28.71,26 | v26.94,23.96 27.6,24.62
  Top 0.152: J1.MP4 32.82,26.66 J1.MP2 32.82,26 J1.MP5 | J1.MP3 21.8,26.66 J1.MP1 | J1.MP6 21.8,26 J1.MP1 | J1.MP1 21.3,25.83 21.3,24.23 20.8,23.73 v20.23,23.73
  Top 0.2: C18.2 v35,19 | R14.2 35.09,16.88 v33.82,16.88 | R13.2 v39.8,9.12 | 47.27,13.47 R12.1 47.27,13.47 | v8.67,4.94 8.42,4.69 U1.3 U1.2 | R2.1 5.8,7.9 v5.84,7.94 | C1.2 8.73,8.68 v10.18,8.68 | C2.2 v15.19,28.68 | v17.26,28.7 C3.2 | v20.23,23.73 18.84,23.73 C7.2 | C6.2 v15.02,23.81 | C14.2 v17.97,17.44 v17.96,17.43 | C13.2 v20.13,17.3 | v9.86,23.39 C9.2 | IC1.2 v7.6,17.7 | IC1.19 9.53,18.23 v9,17.7 | IC1.3 7.15,17.2 7.6,16.75 v7.6,16.2 | R7.2 11.95,23.4 v11.95,24.53 | C4.2 0.74,15.15 v0.72,15.17 | C5.2 v1.33,13.4 | v4.62,11.12 6.61,11.12 L3.2 | C10.1 v14.52,19.9 | C11.1 v15.54,18.15 | J1.MP2 33.43,26.33 34.59,27.49 C23.2 | C19.2 v35.29,22.44 | C20.2 v37.39,22.45 | C21.2 v39.5,22.47 | IC3.13 IC3.12 IC3.11 | IC3.17 42.73,17.38 | 42.73,17.38 v42.71,17.39 | 47.27,13.47 IC3.11 | IC3.9 38.83,14.12 v38.15,13.45 | IC3.21 42.71,17.36 42.73,17.38 | IC3.11 45.65,12.25 v45.8,12.1
  Top 0.4: J2.24 | IC1.25 7.6,16.27 v7.6,16.2 | U1.9 v8.67,4.94
  Top 0.406: C23.2 C22.2
  other vias: 25.54,10.43 25.42,13.06 26.56,8.81 17.12,4.43 32.16,4.43 42.71,15.39 9,16.2 35.7,27.5 38.7,27.5
  pour Route2: -2,32 56,32 56,-2 -2,-2
  pour Route15: -1,31 55,31 55,-1 -1,-1
LCD_BIAS_EN  (via drill 0.35)
  Top 0.127: IC1.8 IC1.9 IC1.10 IC1.11
  Top 0.2: IC1.11 9,14.97 v9,14
  Route2 0.2: v9,14 9,10.89 16.86,3.04 JP1.1
LCD_BL_EN
  Top 0.2: JP1.4 39.61,5.58 37.19,8 37.19,14.47 38.8,16.07 IC3.6 40.58,16.07 40.85,16.35 40.85,17.1 40.58,17.38 IC3.4
LCD_BL_FAULT
  Top 0.2: JP1.2 35.98,6.98 35.98,13.9 38.8,16.73 IC3.5
LCD_BL_K1  (via drill 0.2, 0.35)
  Top 0.127: J1.45 30.81,23.99 v31.01,23.79
  Top 0.2: v47.3,15.3 46.52,16.07 IC3.15 44.81,16.07 44.38,16.51 v44.38,16.72
  Route2 0.2: v47.3,15.3 47.3,7.88 JP1.8
  Route15 0.2: v31.01,23.79 34.82,19.98 41.69,19.98 44.38,17.29 v44.38,16.72
LCD_BL_K2  (via drill 0.2)
  Top 0.127: J1.47 31.16,25.03 v31.99,24.2
  Top 0.2: IC3.14 45,15.43 44.76,15.43 v44.37,15.03 44.37,7.49 JP1.6
  Route2 0.2: v31.99,24.2 39.69,16.5 42.9,16.5 v44.37,15.03
LCD_BL_LEDPWM
  Top 0.127: J1.48 31.16,28.35 31.61,28.8 44.66,28.8 U$1.2
LCD_BL_PWM
  Top 0.2: JP1.3 41.18,4.3 41.18,15.02 40.77,15.43 IC3.7
LCD_IOVDD_EN  (via drill 0.2)
  Top 0.2: U1.1 7.15,6.17 v7.15,6.45
  Route2 0.2: v7.15,6.45 7.15,4.25 10.4,1 41,1 42.46,2.46 JP1.5
LCD_RESET_N
  Top 0.127: J1.42 30.11,28.71 31.04,29.64 | U$1.4 48.9,29.64 31.04,29.64 | R16.1 12.55,27.95 14.24,29.64 31.04,29.64
LCD_TEARING
  Top 0.127: J1.44 30.46,28.54 31.15,29.23 46.77,29.23 U$1.3
N$1
  Top 0.2: U1.7 10.76,5.19 11.21,5.64 L2.1
N$2
  Top 0.2: IC1.4 4.55,16.7 R4.1 C4.1
N$3  (via drill 0.35)
  Top 0.2: U$4.P$1 42.48,22.43 v42.4,22.35 | v47.56,18.84 46.74,18.02 IC3.18
  Route2 0.2: v47.56,18.84 47.56,20.17 45.38,22.35 v42.4,22.35
N$4
  Top 0.2: IC1.24 IC1.1 5,18.2 L1.2 4.4,19.15 3.26,20.29 2.36,20.29 U$2.P$1
N$5
  Top 0.2: L3.1 8.79,13.14 U$3.P$2 9.76,12.88 10.23,13.35 IC1.13 IC1.14
N$6  (via drill 0.35)
  Top 0.2: 18.72,22.11 C7.1 | C8.1 4.6,22.05 U$2.P$2 | R6.1 6.21,22.46 C8.1 | C8.1 6.76,21.09 6.76,20.19 7.53,19.42 IC1.23
  Top 0.4: C6.1 18.72,22.11 | C7.1 20.32,22.13 R5.1
  Route2 0.2: R6.1 16.22,22.46 C6.1
  other vias: 7.82,22.46 16.57,22.11
N$7
  Top 0.2: C9.1 9.31,20.45 8.53,19.67 IC1.21
N$8  (via drill 0.35)
  Top 0.2: R6.2 8.03,20.55 IC1.22
  Route2 0.2: C8.2 7.41,20.35 R6.2 8.71,21.65 R7.1
  other vias: 5.8,20.35 7.82,20.76 12,21.65
N$9  (via drill 0.35)
  Top 0.2: C14.1 18.01,20.46 | C13.1 20.43,20.16 | IC1.15 10.89,16.7 11.14,16.45 11.14,14.23 C12.2 | R10.2 C12.2 | U$3.P$1 11.81,13.34 C12.2
  Top 0.4: 18.01,20.46 C13.1 | 20.43,20.16 R8.1 | R10.2 16.43,15.67 16.43,19.29 17.64,20.5 C14.1
  other vias: 17.97,20.5 12.03,13.34
N$10
  Top 0.2: IC1.17 10.28,17.75 11.6,17.75 R9.1 13.7,16.45 C11.2
N$11
  Top 0.2: IC1.18 11.55,19.52 C10.2
N$12
  Top 0.2: R10.1 C12.1 12,15.07 R9.2 11.25,17.2 IC1.16
N$14
  Top 0.2: R11.2 C17.1 | C17.1 47.52,16.73 IC3.16 | R12.2 49.1,13.35 C17.1
N$15
  Top 0.2: 38.27,18.68 37.98,18.98 | 37.98,18.98 C18.1 | IC3.2 38.27,18.68 | 38.27,18.68 37.98,18.98
N$16
  Top 0.2: R13.1 39.8,13.45 IC3.10
N$17
  Top 0.2: R14.1 38.03,18.02 IC3.3
NET_WHATEVER
  Top 0.4: R11.1 C17.2 49.1,22.16 U$4.P$2 43.74,27.52 41.46,27.52
  Top 0.406: 41.46,27.52 38.68,24.74 C22.1 C23.1 34.33,24.69 R15.1

### Text on the board
tNames: RST | TEAR | LEDPWM | GND | BL_EN | K2 | FLT | K1 | JLCJLCJLCJLCJLC | +5V | BI_EN | PWM | IOVDD